# Altium schematic sheet RS232.SchDoc
size A4; SheetNumber: 3; SheetTotal: 15
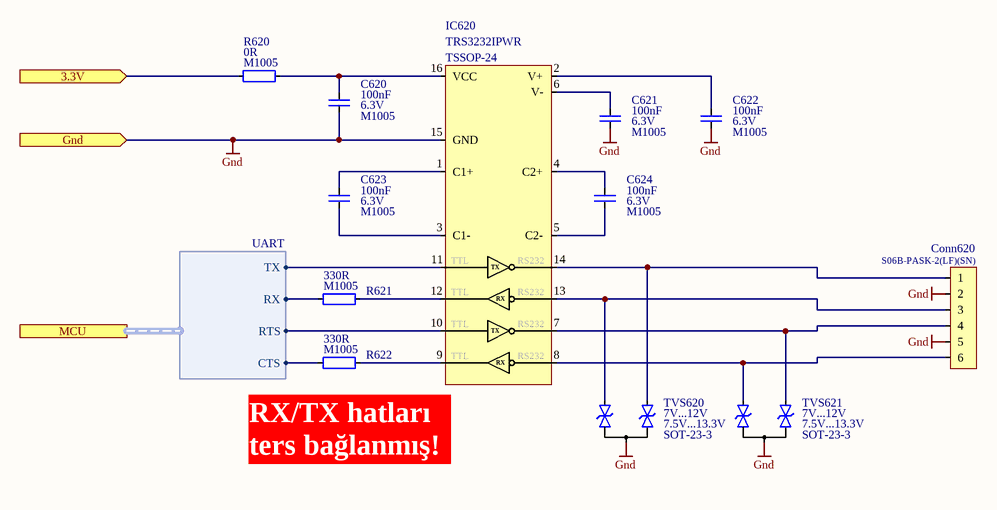
[diagram p0: RS232.SchDoc]

## Parts
C620  value 100nF  Voltage: 6.3V  Package: M1005  [Capacitor_Ceramic_M1005_I0402]  (hidden comment: Capacitor_Ceramic)
C621  value 100nF  Voltage: 6.3V  Package: M1005  [Capacitor_Ceramic_M1005_I0402]  (hidden comment: Capacitor_Ceramic)
C622  value 100nF  Voltage: 6.3V  Package: M1005  [Capacitor_Ceramic_M1005_I0402]  (hidden comment: Capacitor_Ceramic)
C623  value 100nF  Voltage: 6.3V  Package: M1005  [Capacitor_Ceramic_M1005_I0402]  (hidden comment: Capacitor_Ceramic)
C624  value 100nF  Voltage: 6.3V  Package: M1005  [Capacitor_Ceramic_M1005_I0402]  (hidden comment: Capacitor_Ceramic)
Conn620  Manufacturer Part Number: S06B-PASK-2(LF)(SN)  [Connector, S06B-PASK-2]  (hidden comment: Connector - 6P)
IC620  Manufacturer Part Number: TRS3232IPWR  Package: TSSOP-24  [TSSOP-16]  (hidden comment: RS232 - Texas, TRS3232IPWR)
R620  value 0R  Package: M1005  [Resistor_Smd_M1005_I0402]  (hidden comment: Resistor)
R621  value 330R  Package: M1005  [Resistor_Smd_M1005_I0402]  (hidden comment: Resistor)
R622  value 330R  Package: M1005  [Resistor_Smd_M1005_I0402]  (hidden comment: Resistor)
TVS620  Voltage, Break Down: 7.5V...13.3V  Voltage, Stand Off: 7V...12V  Package: SOT-23-3  [Diode_SOT-23-3_2P_Bidirectional_Type_1]  (hidden comment: Diode_Tvs_2P_Bidirectional)
TVS621  Voltage, Break Down: 7.5V...13.3V  Voltage, Stand Off: 7V...12V  Package: SOT-23-3  [Diode_SOT-23-3_2P_Bidirectional_Type_1]  (hidden comment: Diode_Tvs_2P_Bidirectional)

## Ports
3.3V (in), Gnd (in), MCU (harness UART)

## Harnesses
UART: RX, TX, RTS, CTS

## Nets
Gnd: C620.2 C621.2 C622.2 Conn620.2 Conn620.5 IC620.15(GND) TVS620.Common TVS621.Common ; port Gnd
3.3V: R620.1 ; port 3.3V
NetC620_1: C620.1 IC620.16(VCC) R620.2
NetC621_1: C621.1 IC620.6(V-)
NetC622_1: C622.1 IC620.2(V+)
NetC623_1: C623.1 IC620.1(C1+)
NetC623_2: C623.2 IC620.3(C1-)
NetC624_1: C624.1 IC620.4(C2+)
NetC624_2: C624.2 IC620.5(C2-)
NetConn620_1: Conn620.1 IC620.14(DOUT1) TVS620.D2
NetConn620_3: Conn620.3 IC620.13(RIN1) TVS620.D1
NetConn620_4: Conn620.4 IC620.7(DOUT2) TVS621.D2
NetConn620_6: Conn620.6 IC620.8(RIN2) TVS621.D1
NetIC620_9: IC620.9(ROUT2) R622.2
NetIC620_10: IC620.10(DIN2) ; port MCU.RTS
NetIC620_11: IC620.11(DIN1) ; port MCU.TX
NetIC620_12: IC620.12(ROUT1) R621.2
NetR621_1: R621.1 ; port MCU.RX
NetR622_1: R622.1 ; port MCU.CTS

## Notes on the sheet
- RX/TX hatları ters bağlanmış!
- (in symbol RS232 - Texas, TRS3232IPWR) TTL; TX; RS232; RX

## Library data of the parts
C620-C624 = Capacitor_Ceramic: Cap, Cer, 100nF, 6.3V, M1005; Manufacturer Part Number: 04026D104KAT4A; Manufacturer: Kyocera; Temperature Coefficient: X5R; Tolerance: 10%; ComponentLink1Description: Datasheet; ComponentLink1URL: E:\Altium\Datasheets\Capacitor\Kyocera - X5R.pdf; ComponentLink2Description: Supplier Link; ComponentLink2URL: https://www.digikey.com/en/products/detail/kyocera-avx/04026D104KAT4A/8107673; Supplier: Digikey; Supplier Part Number: 478-11504-1-ND; Operating Temperature, Min: +85℃; Operating Temperature, Max: -55℃; Quantity, Min: 1; Quantity, Max: 250000; Price, Min: 0.1; Supplier Currency: $; Price, Max: 0.00189; Supplier Link: https://www.digikey.com/en/products/detail/kyocera-avx/04026D104KAT4A/8107673; Component Type: Ceramic; Component Category: Capacitor
Conn620 = Connector - 6P: Conn, JST, 6P, TH, PA, Side Entry; ComponentLink1Description: Datasheet; ComponentLink1URL: E:\Altium\Datasheets\Connector - JST\PA Family.pdf; ComponentLink2Description: Supplier Link; ComponentLink2URL: https://www.digikey.com/en/products/detail/jst-sales-america-inc/S06B-PASK-2-LF-SN/926757; Supplier: Digikey; Supplier Part Number: 455-1851-ND; Manufacturer: JST; Operating Temperature, Min: -25℃; Operating Temperature, Max: +85℃; Quantity, Min: 1; Quantity, Max: 10000; Price, Min: 0.51; Supplier Currency: $; Price, Max: 0.21423; Supplier Link: https://www.digikey.com/en/products/detail/jst-sales-america-inc/S06B-PASK-2-LF-SN/926757; Component Type: PCB; Component Category: Connector; Package: TH, Side
IC620 = RS232 - Texas, TRS3232IPWR: IC, Interface, RS232, TSSOP-24; ComponentLink1Description: Datasheet; ComponentLink1URL: E:\Altium\Datasheets\IC - Interface\RS232 - Texas, TRS3232.pdf; ComponentLink2Description: Supplier Link; ComponentLink2URL: https://www.digikey.com/en/products/detail/texas-instruments/TRS3232IPWR/1909117; Supplier: Digikey; Supplier Part Number: 296-25041-1-ND; Manufacturer: Texas; Operating Temperature, Min: -55℃; Operating Temperature, Max: +85℃; Quantity, Min: 1; Quantity, Max: 2000; Price, Min: 1.95; Supplier Currency: $; Price, Max: 0.9984; Supplier Link: https://www.digikey.com/en/products/detail/texas-instruments/TRS3232IPWR/1909117; Component Type: Interface; Component Category: IC
R620 = Resistor: Res, 0R, M1005; Manufacturer: Yageo; Manufacturer Part Number: RC0402FR-070RL; Component Category: Resistor; Component Type: Fixed Value; Tolerance: *; Supplier Link: https://www.digikey.com/en/products/detail/yageo/RC0402FR-070RL/2827570; Supplier Currency: $; Price, Max: 0.00109; Price, Min: 0.1; Quantity, Max: 50000; Quantity, Min: 1; Operating Temperature, Max: -55℃; Operating Temperature, Min: +155℃; Supplier Part Number: 311-0.0LRCT-ND; Supplier: Digikey; ComponentLink1Description: Datasheet; ComponentLink1URL: E:\Altium\Datasheets\Resistor\Yageo - RC_L Series.pdf; ComponentLink2Description: Supplier Link; ComponentLink2URL: https://www.digikey.com/en/products/detail/yageo/RC0402FR-070RL/2827570
R621 R622 = Resistor: Res, 330R, 1%, M1005; Manufacturer: Yageo; Manufacturer Part Number: RC0402FR-07330RL; Component Category: Resistor; Component Type: Fixed Value; Tolerance: 1%; Supplier Link: https://www.digikey.com/en/products/detail/yageo/RC0402FR-07330RL/726594; Supplier Currency: $; Price, Max: 0.00129; Price, Min: 0.1; Quantity, Max: 100000; Quantity, Min: 1; Operating Temperature, Max: -55℃; Operating Temperature, Min: +155℃; Supplier Part Number: 311-330LRCT-ND; Supplier: Digikey; ComponentLink1Description: Datasheet; ComponentLink1URL: E:\Altium\Datasheets\Resistor\Yageo - RC_L Series.pdf; ComponentLink2Description: Supplier Link; ComponentLink2URL: https://www.digikey.com/en/products/detail/yageo/RC0402FR-07330RL/726594
TVS620 TVS621 = Diode_Tvs_2P_Bidirectional: TVS, 2P, Bidirectional, 7V/12V, SOT-23-3; Manufacturer Part Number: CDSOT23-SM712; Manufacturer: Bourns; Component Category: Diode; ComponentLink1Description: Datasheet; ComponentLink1URL: E:\Altium\Datasheets\Diode\Bourns, CDSOT23-SM712.pdf; ComponentLink2Description: Supplier Link; ComponentLink2URL: https://www.digikey.com/en/products/detail/bourns-inc/CDSOT23-SM712/1630592; Supplier: Digikey; Supplier Part Number: CDSOT23-SM712CT-ND; Operating Temperature, Min: -55℃; Operating Temperature, Max: +150℃; Quantity, Min: 1; Quantity, Max: 3000; Price, Min: 1.59; Price, Max: 0.675; Supplier Currency: $; Supplier Link: https://www.digikey.com/en/products/detail/bourns-inc/CDSOT23-SM712/1630592; Component Type: TVS